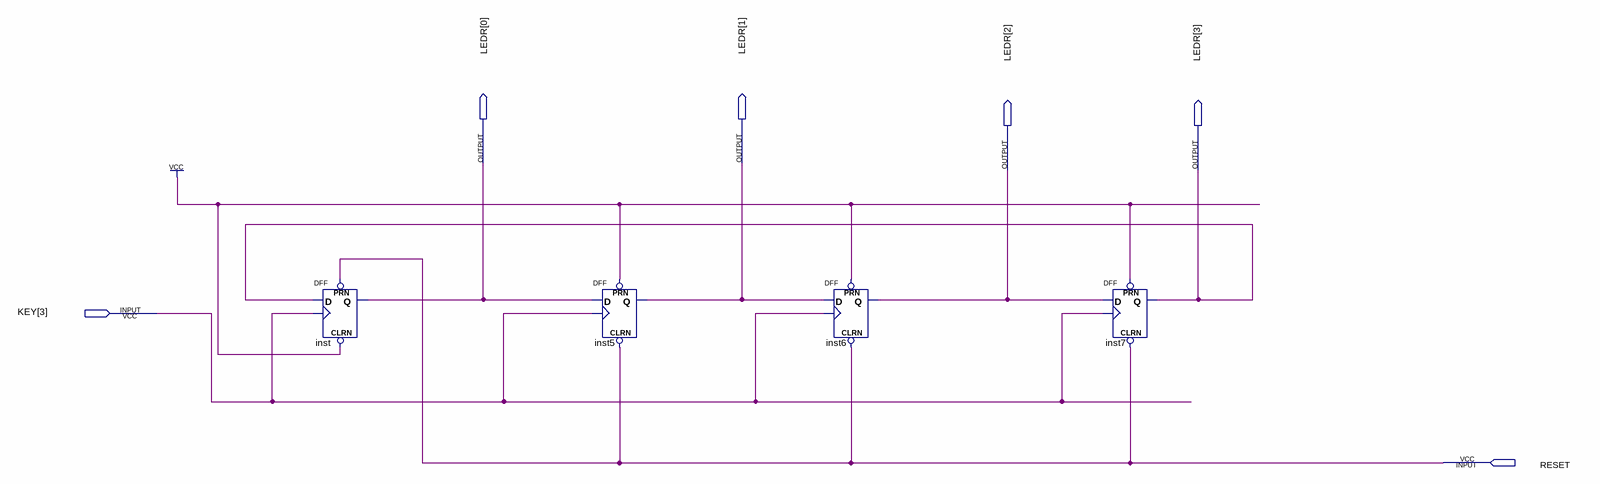
[diagram p0: schematic sheet]
// Quartus schematic Block8.bdf as structural Verilog: 4 symbols, 6 pins
module Block8 (
  input  [3:3] KEY,
  input  RESET,
  output [3:0] LEDR
);

  DFF inst (.CLRN(1'b1), .CLK(KEY[3]), .D(LEDR[3]), .PRN(RESET), .Q(LEDR[0]));
  DFF inst5 (.CLRN(RESET), .CLK(KEY[3]), .D(LEDR[0]), .PRN(1'b1), .Q(LEDR[1]));
  DFF inst6 (.CLRN(RESET), .CLK(KEY[3]), .D(LEDR[1]), .PRN(1'b1), .Q(LEDR[2]));
  DFF inst7 (.CLRN(RESET), .CLK(KEY[3]), .D(LEDR[2]), .PRN(1'b1), .Q(LEDR[3]));
endmodule
